# Altium schematic sheet Motor Drivers.SchDoc
size A
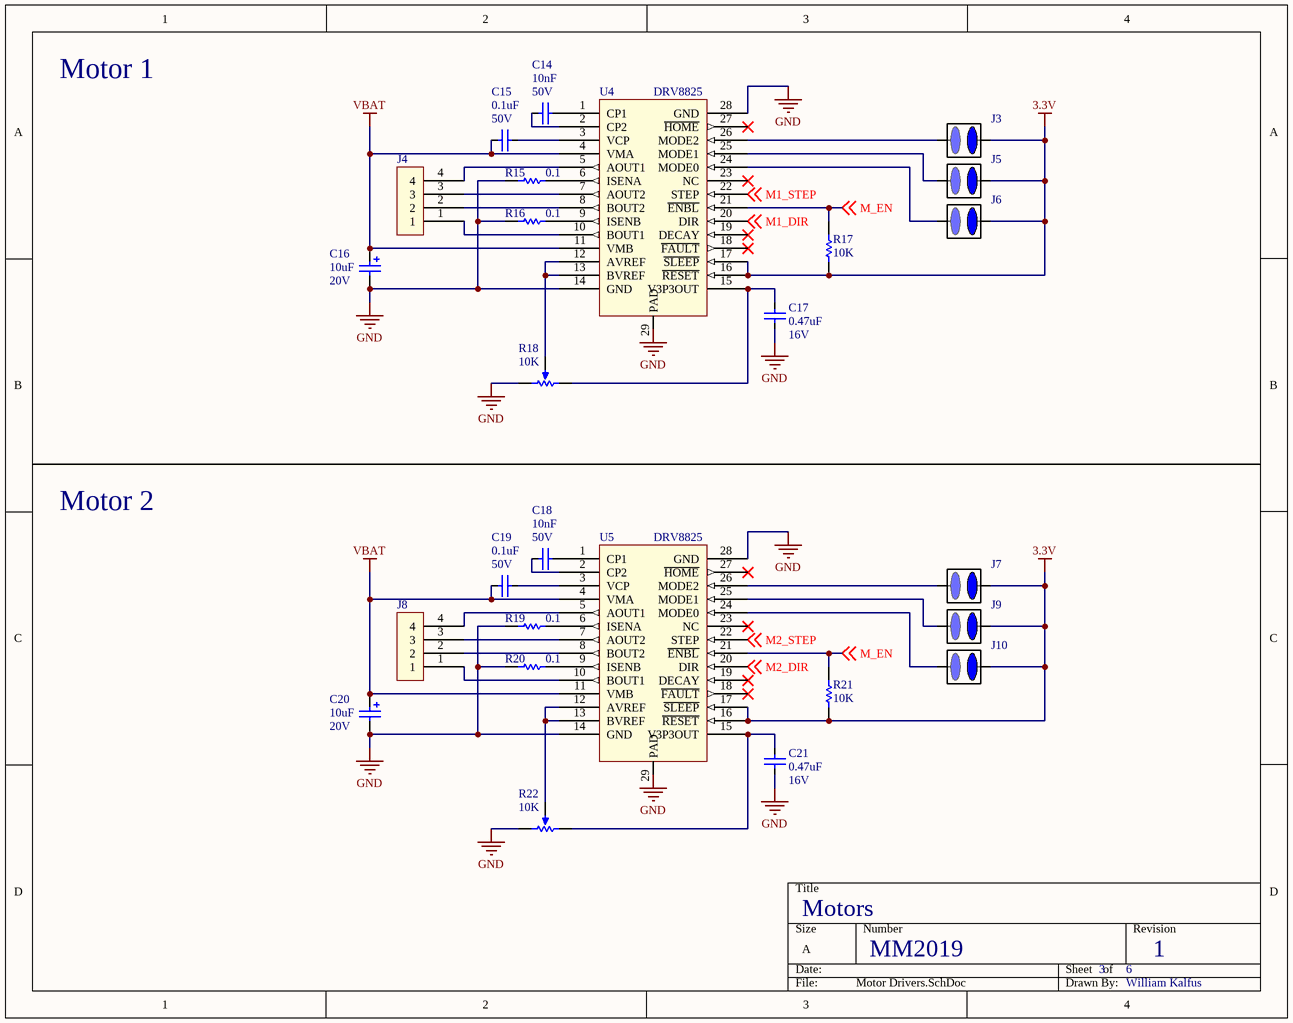
[diagram p0: Motor Drivers.SchDoc]

## Parts
C14  value 10nF  Voltage Rating: 50V  [J1-0603]  (hidden comment: CAP)
C15  value 0.1uF  Voltage Rating: 50V  [J1-0603]  (hidden comment: CAP)
C16  value 10uF  Voltage Rating: 20V  [1206+]  (hidden comment: CAP POL)
C17  value 0.47uF  Voltage Rating: 16V  [J1-0603]  (hidden comment: CAP)
C18  value 10nF  Voltage Rating: 50V  [J1-0603]  (hidden comment: CAP)
C19  value 0.1uF  Voltage Rating: 50V  [J1-0603]  (hidden comment: CAP)
C20  value 10uF  Voltage Rating: 20V  [1206+]  (hidden comment: CAP POL)
C21  value 0.47uF  Voltage Rating: 16V  [J1-0603]  (hidden comment: CAP)
J3  JUMPER  [JUMPER]  (value not drawn)
J4  CONN_4x1  [CONN_4x1]  (value not drawn)
J5  JUMPER  [JUMPER]  (value not drawn)
J6  JUMPER  [JUMPER]  (value not drawn)
J7  JUMPER  [JUMPER]  (value not drawn)
J8  CONN_4x1  [CONN_4x1]  (value not drawn)
J9  JUMPER  [JUMPER]  (value not drawn)
J10  JUMPER  [JUMPER]  (value not drawn)
R15  value 0.1  [J1-0603]
R16  value 0.1  [J1-0603]
R17  value 10K  [J1-0603]
R18  value 10K  [ST32-EB]  (hidden comment: POT ST32ETB103)
R19  value 0.1  [J1-0603]
R20  value 0.1  [J1-0603]
R21  value 10K  [J1-0603]
R22  value 10K  [ST32-EB]  (hidden comment: POT ST32ETB103)
U4  DRV8825  [PP28]
U5  DRV8825  [PP28]

## Nets
3.3V: J3.2 J5.2 J6.2 J7.2 J9.2 J10.2 R17.2 R21.2 U4.16(~{RESET}) U4.17(~{SLEEP}) U5.16(~{RESET}) U5.17(~{SLEEP})
GND: C16.2 C17.2 C20.2 C21.2 R15.2 R16.2 R18.3(BOT) R19.2 R20.2 R22.3(BOT) U4.14(GND) U4.28(GND) U4.29(PAD) U5.14(GND) U5.28(GND) U5.29(PAD)
VBAT: C15.2 C16.1 C19.2 C20.1 U4.4(VMA) U4.11(VMB) U5.4(VMA) U5.11(VMB)
M1_DIR: U4.20(DIR) ; off-sheet M1_DIR
M1_STEP: U4.22(STEP) ; off-sheet M1_STEP
M2_DIR: U5.20(DIR) ; off-sheet M2_DIR
M2_STEP: U5.22(STEP) ; off-sheet M2_STEP
M_EN: R17.1 R21.1 U4.21(~{ENBL}) U5.21(~{ENBL}) ; off-sheet M_EN
NetC14_1: C14.1 U4.1(CP1)
NetC14_2: C14.2 U4.2(CP2)
NetC15_1: C15.1 U4.3(VCP)
NetC17_1: C17.1 R18.1(TOP) U4.15(V3P3OUT)
NetC18_1: C18.1 U5.1(CP1)
NetC18_2: C18.2 U5.2(CP2)
NetC19_1: C19.1 U5.3(VCP)
NetC21_1: C21.1 R22.1(TOP) U5.15(V3P3OUT)
NetJ3_1: J3.1 U4.26(MODE2)
NetJ4_1: J4.1 U4.10(BOUT1)
NetJ4_2: J4.2 U4.8(BOUT2)
NetJ4_3: J4.3 U4.7(AOUT2)
NetJ4_4: J4.4 U4.5(AOUT1)
NetJ5_1: J5.1 U4.25(MODE1)
NetJ6_1: J6.1 U4.24(MODE0)
NetJ7_1: J7.1 U5.26(MODE2)
NetJ8_1: J8.1 U5.10(BOUT1)
NetJ8_2: J8.2 U5.8(BOUT2)
NetJ8_3: J8.3 U5.7(AOUT2)
NetJ8_4: J8.4 U5.5(AOUT1)
NetJ9_1: J9.1 U5.25(MODE1)
NetJ10_1: J10.1 U5.24(MODE0)
NetR15_1: R15.1 U4.6(ISENA)
NetR16_1: R16.1 U4.9(ISENB)
NetR18_2: R18.2(TAP) U4.12(AVREF) U4.13(BVREF)
NetR19_1: R19.1 U5.6(ISENA)
NetR20_1: R20.1 U5.9(ISENB)
NetR22_2: R22.2(TAP) U5.12(AVREF) U5.13(BVREF)

Not connected (* = marked no-connect by the designer): U4 18(~{FAULT})* 19(DECAY)* 23(NC)* 27(~{HOME})*; U5 18(~{FAULT})* 19(DECAY)* 23(NC)* 27(~{HOME})*

## Notes on the sheet
- Motor 1
- Motor 2
- Motors
- MM2019
- 3
- 6
- 1
- William Kalfus

## Library data of the parts
C14 C18 = CAP: CAP CER 10000PF 50V X7R 0603; Supplier Part Number 1: 311-1085-1-ND; Supplier 1: Digi-Key
C15 C19 = CAP: CAP CER 0.1UF 50V X7R 0603; Supplier Part Number 1: 399-6856-1-ND; Supplier 1: Digi-Key
C16 C20 = CAP POL: CAP TANT 10UF 10% 20V 1206; Published: 8-Jun-2000; LatestRevisionDate: 17-Jul-2002; LatestRevisionNote: Re-released for DXP Platform.; PackageReference: RB7.6-15; Publisher: Altium Limited; PackageDescription: Polarized Capacitor (Radial); 2 Leads; Supplier Part Number 1: 478-8273-1-ND; Supplier 1: Digi-Key
C17 C21 = CAP: CAP CER 0.47UF 16V X7R 0603; Supplier Part Number 1: 490-3295-1-ND; Supplier 1: Digi-Key
J4 J8 = CONN_4x1: CONN HEADER 4POS .100 R/A 30AU; Manufacturer: Amphenol FCI; Manufacturer Part Number: 68016-104HLF; Pitch - Mating: 0.100" (2.54mm); Number of Positions: 4; Number of Positions Loaded: All; Style: Board to Board; Shrouding: Unshrouded; Contact Length - Mating: 0.230" (5.84mm); Contact Length - Post: 0.120" (3.05mm); Material Flammability Rating: UL94 V-0; Supplier 1: Digi-Key; Supplier Part Number 1: 609-3312-ND; RoHS: RoHS Compliant; Category: Connectors, Interconnects; Stock 1: 5255; Pricing 1: 1=0.41, 10=0.385, 100=0.2697, 500=0.23122, 1000=0.19268, 5000=0.16515, 10000=0.15414 (USD); Packaging: Bulk; Part Status: Active; Connector Type: Header; Contact Type: Male Pin; Number of Rows: 1; Row Spacing - Mating: -; Mounting Type: Through Hole, Right Angle; Termination: Solder; Fastening Type: Push-Pull; Overall Contact Length: -; Insulation Height: 0.095" (2.41mm); Contact Shape: Square; Contact Finish - Mating: Gold or Gold, GXT™; Contact Finish Thickness - Mating: 30µin (0.76µm); Contact Finish - Post: -; Contact Material: Phosphor Bronze; Insulation Material: -; Features: -; Operating Temperature: -; Ingress Protection: -; Insulation Color: Black; Current Rating: -; Voltage Rating: -; Mated Stacking Heights: -; Contact Finish Thickness - Post: -; Applications: -; ComponentLink1URL: http://cdn.amphenol-icc.com/media/wysiwyg/files/drawing/68015.pdf; ComponentLink1Description: http://cdn.amphenol-icc.com/media/wysiwyg/files/drawing/68015.pdf
R15 R16 R19 R20 = Res1: RES 0.1 OHM 1% 1/3W 0603; Supplier Part Number 1: P17478CT-ND; Supplier 1: Digi-Key
R17 R21 = Res1: RES SMD 10K OHM 5% 1/10W 0603; Supplier Part Number 1: 311-10KGRCT-ND; Supplier 1: Digi-Key
R18 R22 = POT ST32ETB103: 10K Trimmer Potentiometer; Sim Note: Enter the Resistance value and the set point into parameter fields.; Set Position: 0.5; Published: 8-Jun-2000; LatestRevisionDate: 17-Jul-2002; LatestRevisionNote: Re-released for DXP Platform.; PackageReference: VR5; Publisher: Altium Limited; PackageDescription: Variable Resistor, Thru-Hole; 3 Leads; Supplier 1: Digi-Key; Supplier Part Number 1: ST32ETB103CT-ND
U4 U5 = DRV8825: IC MOTOR DRIVER PAR 28HTSSOP; Manufacturer: Texas Instruments; Manufacturer Part Number: DRV8825PWPR; Motor Type - Stepper: Bipolar; Function: Driver - Fully Integrated, Control and Power Stage; Output Configuration: Half Bridge (4); Interface: Logic; Step Resolution: 1 ~ 1/32; Current - Output: 2.5A; Voltage - Supply: 8.2 V ~ 45 V; Supplier 1: Digi-Key; Supplier Part Number 1: 296-29503-1-ND; RoHS: RoHS Compliant; Category: Integrated Circuits (ICs); Stock 1: 21013; Pricing 1: 1=3.93, 10=3.53, 100=2.8922, 500=2.46212, 1000=2.07648 (USD); Packaging: Cut Tape (CT); Part Status: Active; Motor Type - AC, DC: -; Technology: Power MOSFET; Applications: General Purpose; Voltage - Load: 8.2 V ~ 45 V; Operating Temperature: -40°C ~ 150°C (TJ); Mounting Type: Surface Mount; Package / Case: 28-TSSOP (0.173", 4.40mm Width) Exposed Pad; Supplier Device Package: 28-HTSSOP; ComponentLink1URL: http://www.ti.com/lit/ds/symlink/drv8825.pdf; ComponentLink1Description: http://www.ti.com/lit/ds/symlink/drv8825.pdf